# EAGLE design Full-tDCS-1 (EAGLE 6.6.0)
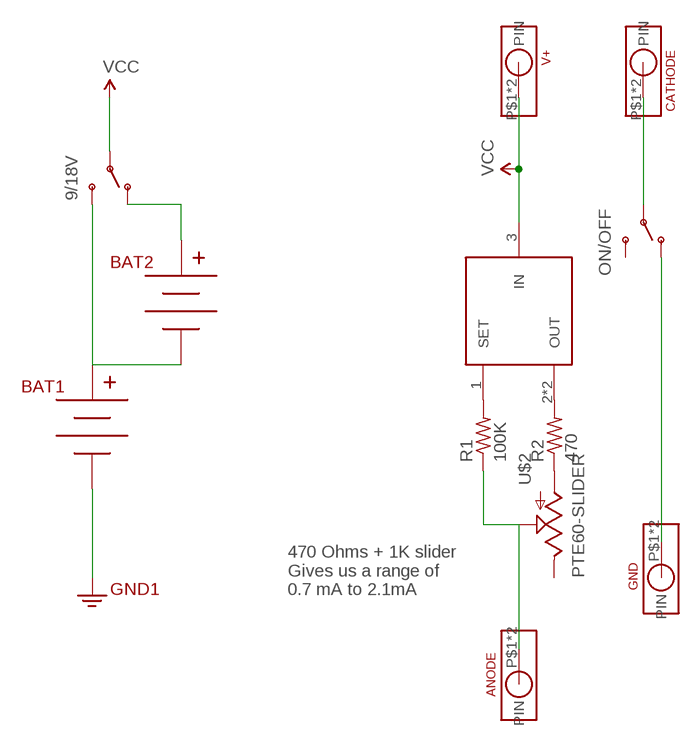
[diagram p0: schematic, sheet 1]

## Parts
9/18V  SWITCH-SPDTPTH  [SWITCH-SPDT]
ANODE  BANANA-JACK  [105-0753-001-BANANA-JACK]
BAT1  BC9VPC  [BC9VPC]
BAT2  BC9VPC  [BC9VPC]
CATHODE  BANANA-JACK  [105-0753-001-BANANA-JACK]
GND  BANANA-JACK  [105-0753-001-BANANA-JACK]
ON/OFF  SWITCH-SPDTPTH  [SWITCH-SPDT]
R1  100K  R-US_0204/7  [0204/7]
R2  470  R-US_0204/7  [0204/7]
U$1  LT3092  LT3092-SOT-223  [SOT223]
U$2  PTE60-SLIDER  [SLIDER]
V+  BANANA-JACK  [105-0753-001-BANANA-JACK]

## Nets
GND: BAT1.V- GND.P$1(PIN) GND.P$2(PIN) ON/OFF.1(O) ; supply symbol labelled GND2
N$1: R1.2 U$1.1(SET)
N$2: R2.2 U$1.2(OUT) U$1.4(OUT)
N$3: R2.1 U$2.1(A)
N$4: 9/18V.3(S) BAT1.V+ BAT2.V-
N$5: 9/18V.1(O) BAT2.V+
N$6: CATHODE.P$1(PIN) CATHODE.P$2(PIN) ON/OFF.2(P)
N$7: ANODE.P$1(PIN) ANODE.P$2(PIN) R1.1 U$2.2(S)
VCC: 9/18V.2(P) U$1.3(IN) V+.P$1(PIN) V+.P$2(PIN)
Unconnected: ON/OFF.3(S) U$2.3(E)

## Notes on the sheet
- 470 Ohms + 1K slider
  Gives us a range of
  0.7 mA to 2.1mA

## Library data of the parts
9/18V ON/OFF = SparkFun-Electromechanical:SWITCH-SPDT: SPDT Switch Simple slide switch, Spark Fun Electronics SKU : COM-00102 DPDT SMT slide switch, AYZ0202, SWCH-08179
ANODE CATHODE GND V+ = LT3092:BANANA-JACK
BAT1 BAT2 = SparkFun-Connectors:BC9VPC: 9V board-mount battery cradle; PROD_ID: BATT-10855
R1 R2 = adafruit:R-US_: RESISTOR, American symbol
U$1 = LT3092:LT3092-SOT-223
U$2 = LT3092:PTE60-SLIDER

## Net classes
0 default: width 1.27 mm, clearance 0.508 mm

## Board
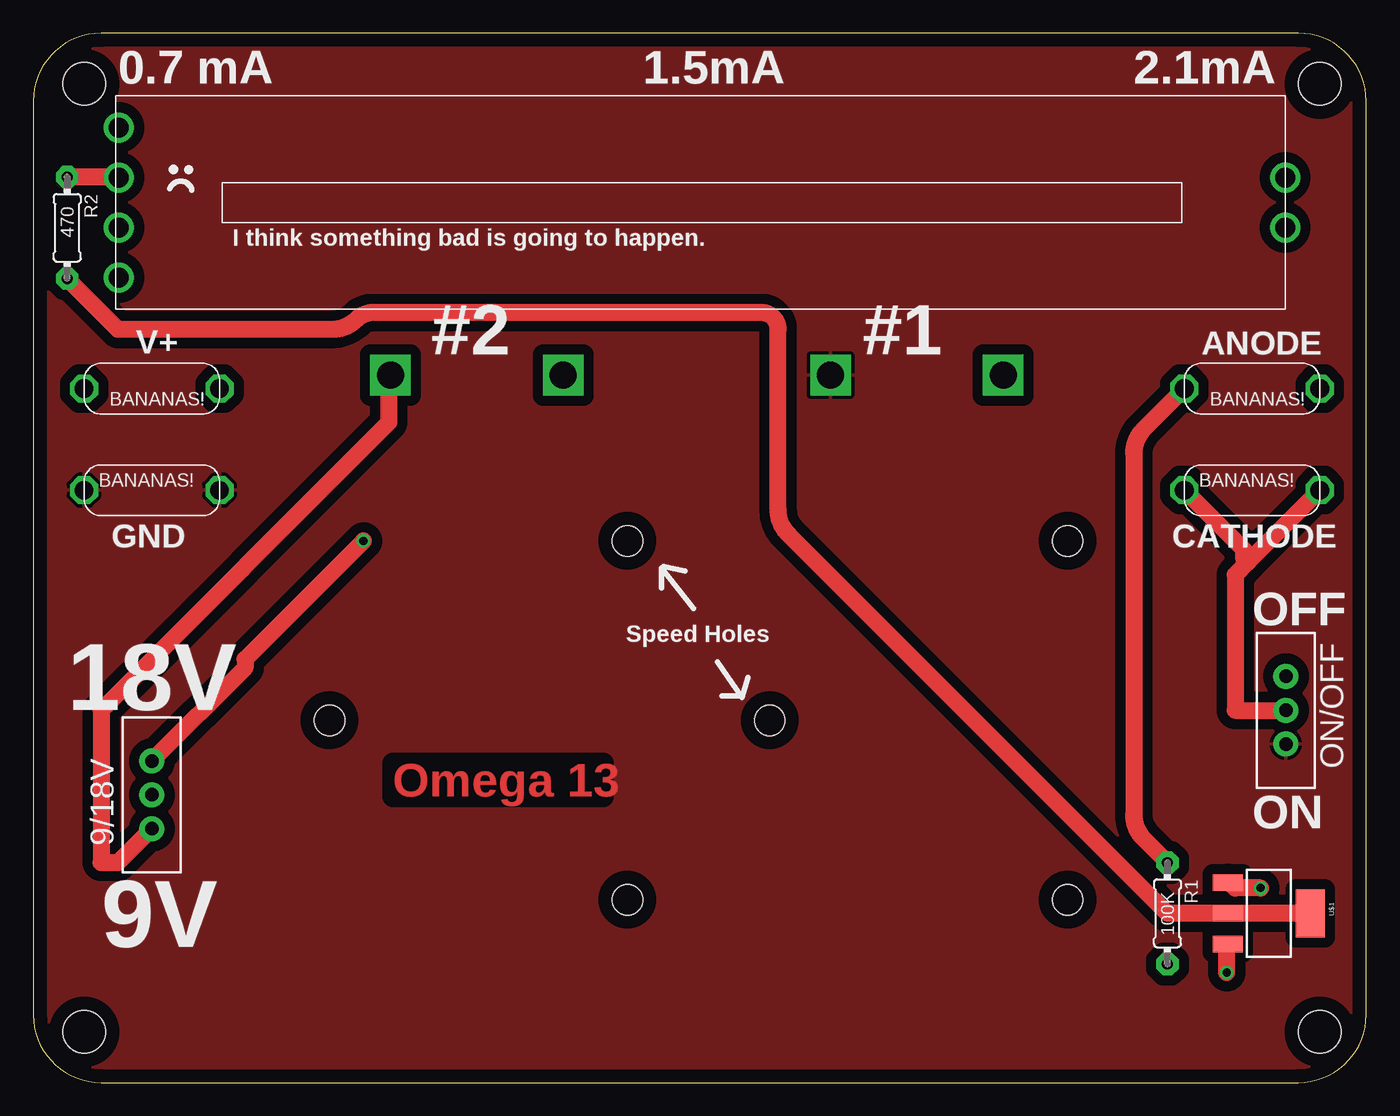
[diagram p1: board, top side]
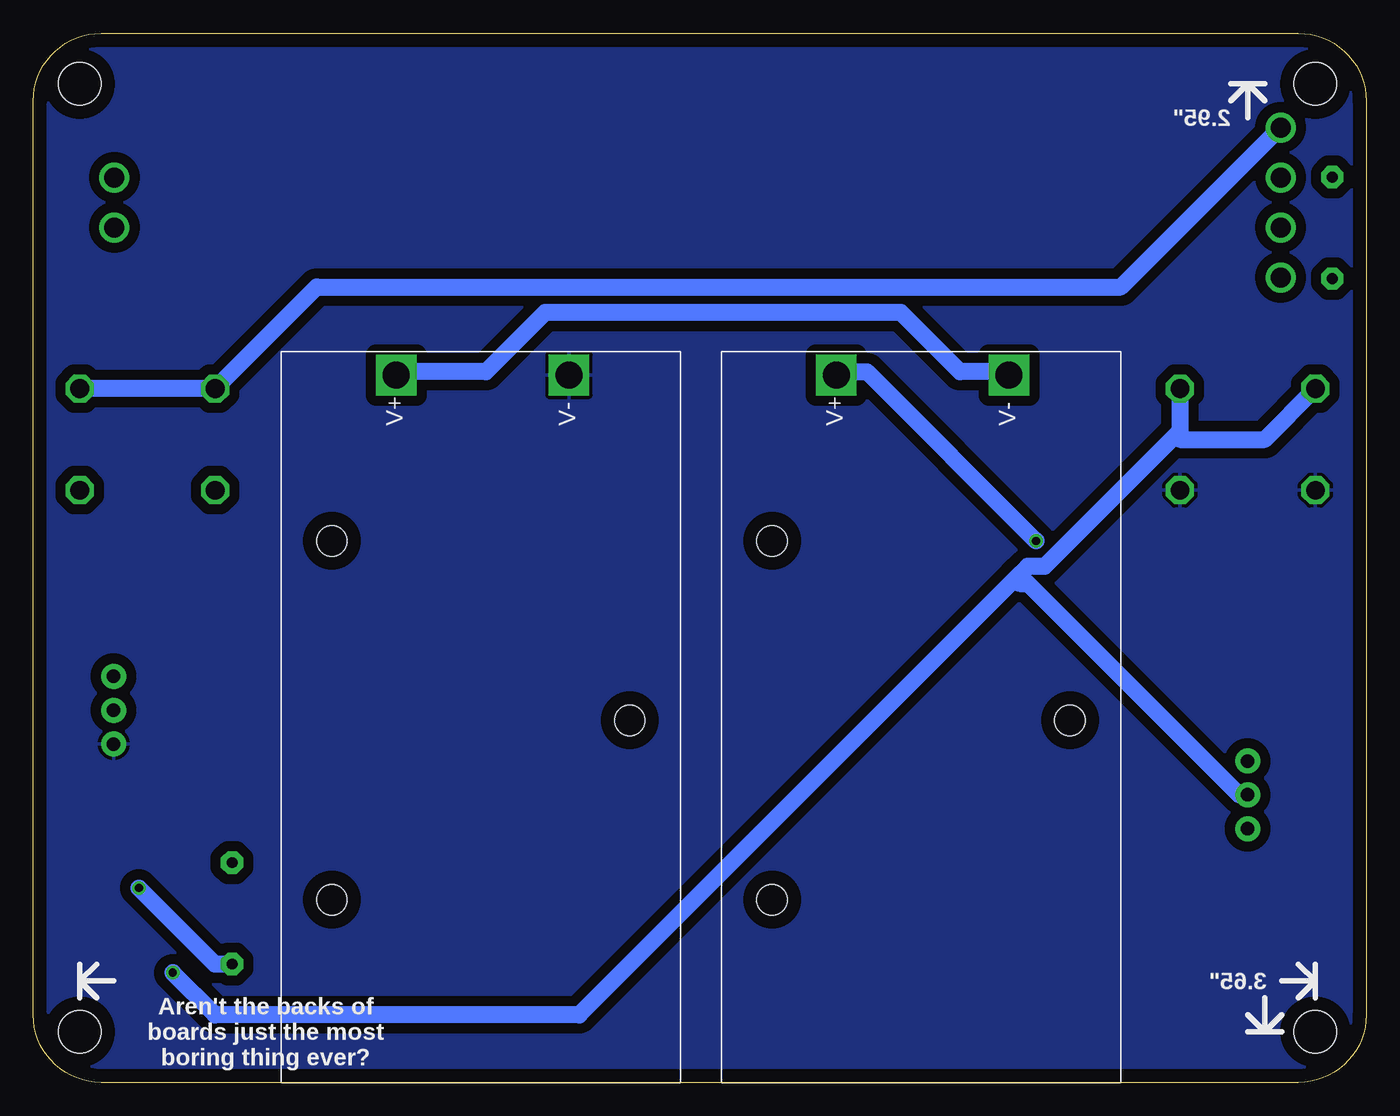
[diagram p2: board, bottom side, seen from below]

Size 100 x 78.73 mm. Coordinates in mm from the lower left corner, seen from the top.
Outline: 0,73.65 0,5.08 arc90 5.08,0 94.92,0 arc90 100,5.08 100,73.65 arc90 94.92,78.73 5.08,78.73 arc90 0,73.65
Copper layers (1*16): Top 0.035mm / dielectric 1.5mm / Bottom 0.035mm
Design rules "default": minimum track width 10mil, minimum drill 24mil, track to track 8mil, track to pad 8mil, pad to pad 8mil, via to via 8mil, smd to smd 8mil, copper to edge 40mil, drill to drill 8mil, minimum pad ring 10mil, minimum via ring 8mil, stop-mask expansion 4mil, vias tented up to drill 0mil, thermal gap 10mil
Holes 3.2 mm at 3.81,3.81 3.81,74.93 96.52,74.93 96.52,3.81

### Footprints (pad centres in the part's own frame; a part is rotated, then mirrored left to right if it is on the bottom)
SWITCH-SPDT = drill 1.016 pad 1.88: 1 0,2.54; 2 0,0; 3 0,-2.54
105-0753-001-BANANA-JACK = drill 1.4 octagon: P$1 5.08,0; P$2 -5.08,0
BC9VPC = drill 2.032 square: V+ 53.086,21.336; V- 53.086,8.382 | hole 2.286: 27.178,3.81; 13.716,26.162; 40.64,26.162
0204/7 = drill 0.813 pad 1.676 octagon: 1 -3.81,0; 2 3.81,0
SOT223 = smd 1.219 x 2.235: 1 -2.311,-3.099; 2 0,-3.099; 3 2.311,-3.099 | smd 3.6 x 2.2: 4 0,3.099
SLIDER = drill 1.5 pad 2: 1 -43.75,1.875; 1A -43.75,-1.875; 2 -43.75,5.625; 2A -43.75,-5.625; 3 43.75,1.875; 3A 43.75,-1.875

### Placement (x,y rotation side)
9/18V  8.89,21.59 0 top
ANODE  91.44,52.07 0 top
BAT1  51.44,0 90 bottom
BAT2  18.41,0 90 bottom
CATHODE  91.44,44.45 180 top
GND  8.89,44.45 180 top
ON/OFF  93.98,27.94 180 top
R1  85.09,12.7 270 top
R2  2.54,64.14 270 top
U$1  92.71,12.7 270 top
U$2  50.16,66.04 0 top
V+  8.89,52.07 0 top

### Tracks (layer width: path | path; a pad name or v marks a point on that pad's centre or on a via)
GND
  pour Top (isolate 0.762): 0,78.74 100.33,78.74 100.33,0 0,0
  pour Bottom (isolate 0.762): 0,78.74 100.33,78.74 100.33,0 0,0
N$1  (via drill 0.61)
  Top 1.27: v92.08,14.61 90.17,14.61 U$1.1
  Bottom 1.27: v92.08,14.61 86.36,8.89 R1.2
N$2
  Top 1.27: U$1.4 U$1.2 85.09,12.7 56.62,41.17 arc-45 55.88,42.96 55.88,56.52 arc90 54.61,57.78 25.51,57.78 arc45 24.24,57.26 arc-45 22.44,56.52 6.35,56.52 R2.2
N$3
  Top 1.27: R2.1 6.35,67.94 U$2.1
N$4
  Top 1.27: 9/18V.3 6.35,16.51 5.08,16.51 5.08,27.94 26.67,49.53 26.67,52.7 BAT2.V-
  Bottom 1.27: BAT1.V+ 72.39,53.34 66.04,53.34 61.59,57.78 34.92,57.78 30.48,53.34 27.3,53.34 BAT2.V-
N$5  (via drill 0.61)
  Top 1.27: 9/18V.1 15.88,31.11 15.88,31.75 v24.77,40.64
  Bottom 1.27: v24.77,40.64 37.47,53.34 39.37,53.34 BAT2.V+
N$6
  Top 1.27: ON/OFF.2 90.17,27.94 90.17,38.1 91.12,39.05 | CATHODE.P$2 91.12,39.05 | CATHODE.P$1 90.81,40.01 90.81,39.37 91.12,39.05
N$7
  Top 1.27: R1.1 83.29,18.31 arc-45 82.55,20.1 82.55,47.21 arc-45 83.29,49 ANODE.P$2
  Bottom 1.27: ANODE.P$1 ANODE.P$2 78.74,59.69 18.41,59.69 6.99,71.12 U$2.2
VCC  (via drill 0.61)
  Top 1.27: v89.53,8.26 89.53,10.16 U$1.3
  Bottom 1.27: v89.53,8.26 86.36,5.08 59.05,5.08 26.35,37.78 | 26.35,37.78 25.4,38.73 24.13,38.73 14.29,48.58 | 14.29,48.58 13.97,48.9 V+.P$1 | 9/18V.2 9.53,21.59 25.4,37.47 26.04,37.47 26.35,37.78 | V+.P$2 7.62,48.26 13.97,48.26 14.29,48.58

### Text on the board
Top: Omega 13
tPlace: 0.7 mA | 1.5mA | 2.1mA | #2 | #1 | OFF | 18V | ON | 9V
tStop: Start low ... | and ramp up! | I don't like being on this board. | BRAIN-> | Wheee!!! | Omega 13 | Always attach the / electrodes before / turning on the device.
bStop: LT3092 / Constant Current / Driver | Ooooh noooo! | 20140821
_tsilk: I think something bad is going to happen. | Speed Holes
_bsilk: 2.95" | 3.65" | Aren't the backs of / boards just the most / boring thing ever?